# Altium schematic sheet LVDS_Driver_Subsystem.SchDoc
size A; SheetNumber: 5; SheetTotal: 7
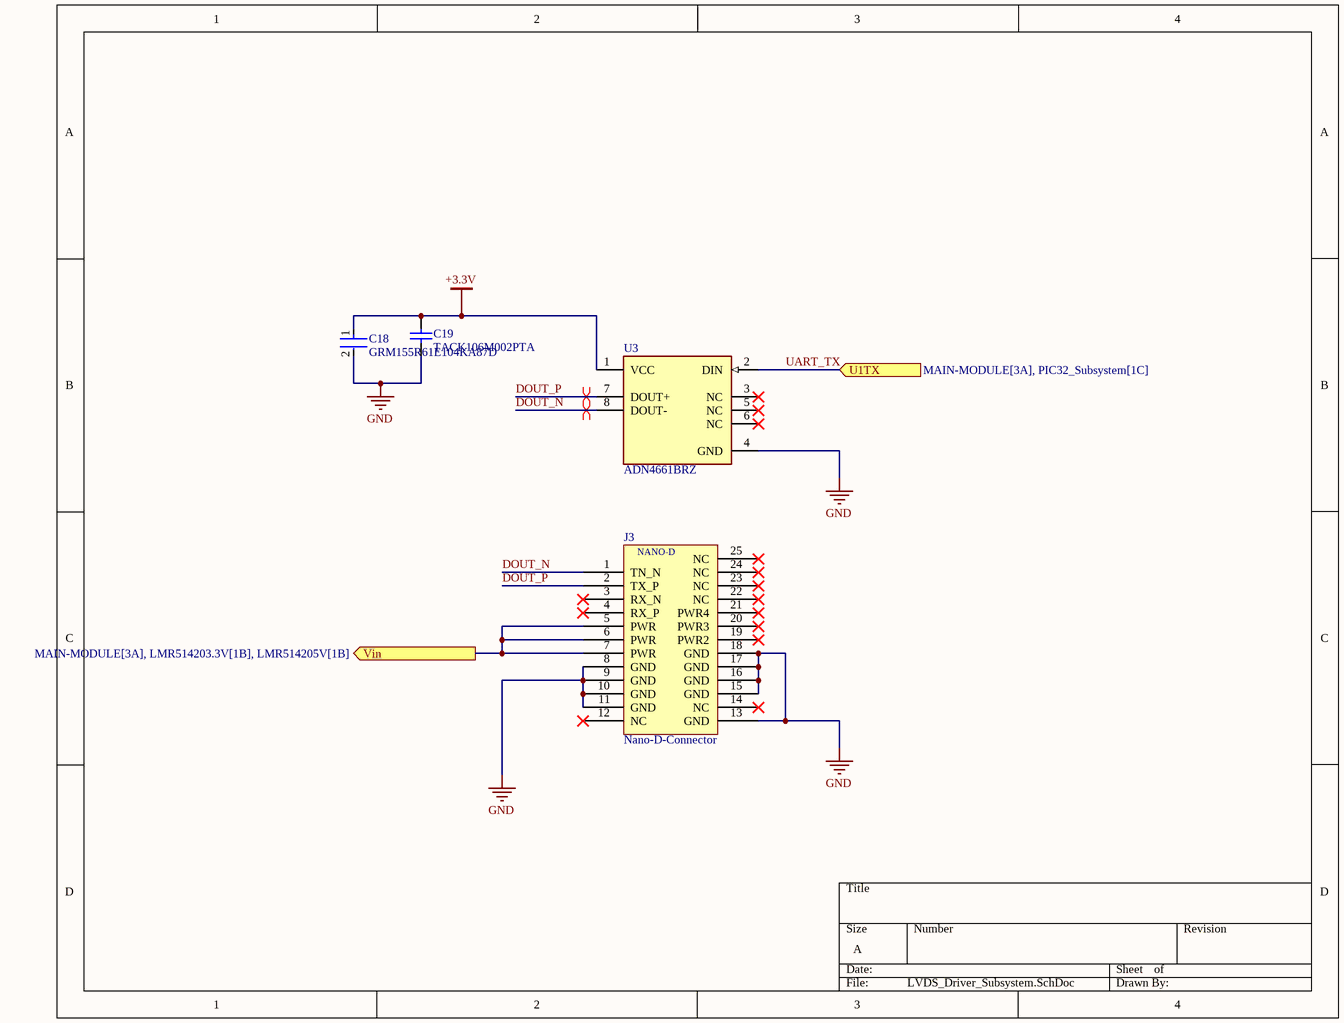
[diagram p0: LVDS_Driver_Subsystem.SchDoc]

## Parts
C18  GRM155R61E104KA87D  [FP-GRM155-0_05-MFG]
C19  TACK106M002PTA  [CAPC1005X70X10NL20T00]
J3  Nano-D-Connector  [A28400-025]
U3  ADN4661BRZ  [FP-R-8-IPC_A]

## Ports
U1TX (in, see MAIN-MODULE[3A], PIC32_Subsystem[1C]), Vin (out, see MAIN-MODULE[3A], LMR514203.3V[1B], LMR514205V[1B])

## Nets
+3.3V: C18.1 C19.2 U3.1(VCC)
GND: C18.2 C19.1 J3.8(GND) J3.9(GND) J3.10(GND) J3.11(GND) J3.13(GND) J3.15(GND) J3.16(GND) J3.17(GND) J3.18(GND) U3.4(GND)
DOUT_N: J3.1(TN_N) U3.8(DOUT-)
DOUT_P: J3.2(TX_P) U3.7(DOUT+)
UART_TX: U3.2(DIN) ; port U1TX
Vin: J3.5(PWR) J3.6(PWR) J3.7(PWR) ; port Vin

Not connected (* = marked no-connect by the designer): J3 3(RX_N)* 4(RX_P)* 12(NC)* 14(NC)* 19(PWR2)* 20(PWR3)* 21(PWR4)* 22(NC)* 23(NC)* 24(NC)* 25(NC)*; U3 3(NC)* 5(NC)* 6(NC)*

## Layout directives
differential pair: DOUT_N, DOUT_P

## Notes on the sheet
- (in symbol Nano-D-Connector) NANO-D

## Library data of the parts
C18 = CMP-2008-04580-2: CAP CER 0.1UF 25V X5R 0402; Lead/Base Style: Bayonet; Capacitance: 100nF; Tolerance: 10%; Material: Ceramic; REACH SVHC: No SVHC; Voltage: 25V; Voltage Rating: 25V; Length: 1mm; Min Operating Temperature: -55°C; Case/Package: 0402; Width: 0.5mm; Termination: Standard; Series: GRM; Mount: Surface Mount; Thickness: 0.022inch; Lead Free: Lead Free; Voltage Rating (DC): 25V; Package Quantity: 10000; Weight: 0.000388oz; Height: 0.5mm; Case Code (Metric): 1005; RoHS Compliant: Yes; Packaging: Cut Tape; Depth: 0.5mm; Case Code (Imperial): 0402; Radiation Hardening: No; Max Operating Temperature: 85°C; Dielectric: X5R
C19 = CMP-2008-00067-1: Manufacturer: AVX Interconnect / Elco; Part Number: TACK106M002PTA
U3 = CMP-09093-000114-1: IC DRIVER 1/0 8SOIC; Supply Current: 7mA; Number of Receivers: 1; Min Supply Voltage: 3V; Max Supply Current: 10mA; Max Supply Voltage: 3.6V; Turn-On Delay Time: 1.5ns; Data Rate: 600Mbps; Operating Supply Voltage: 3.3V; Length: 5mm; Series: -; Number of Pins: 8; REACH SVHC: No SVHC; Mount: Surface Mount; RoHS Compliant: Yes; Packaging: Rail/Tube; Nominal Supply Current: 7mA; Radiation Hardening: No; Number of Drivers: 1; Width: 4mm; Number of Elements: 1; Lead Free: Contains Lead; Operating Supply Current: 7mA; Min Operating Temperature: -40°C; Propagation Delay: 1.5ns; Package Quantity: 98; Height: 1.5mm; Case/Package: SOIC; Max Operating Temperature: 85°C